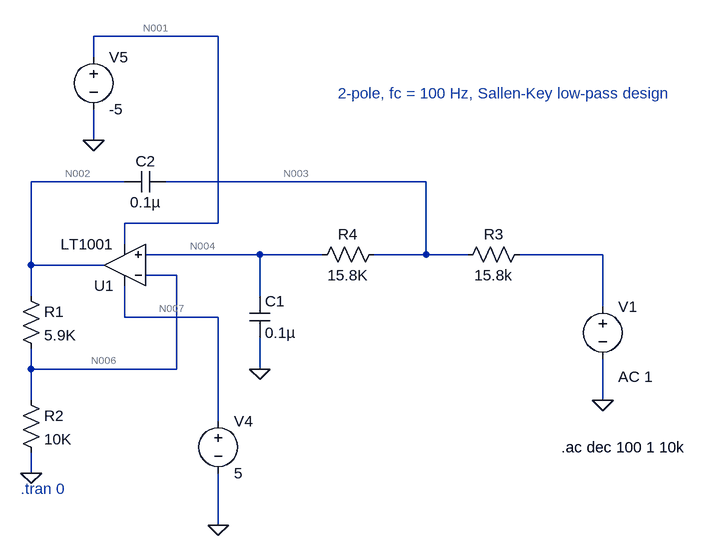
[diagram p0: schematic Draft1.asc]
Draft1.asc, the LTspice schematic file:
Version 4.1
SHEET 1 1392 1204
WIRE -96 304 -288 304
WIRE -288 336 -288 304
WIRE -288 464 -288 416
WIRE -240 528 -384 528
WIRE 224 528 -176 528
WIRE -96 592 -96 304
WIRE -96 592 -240 592
WIRE -240 624 -240 592
WIRE -32 640 -208 640
WIRE 64 640 -32 640
WIRE 224 640 224 528
WIRE 224 640 144 640
WIRE 288 640 224 640
WIRE 496 640 368 640
WIRE -384 656 -384 528
WIRE -272 656 -384 656
WIRE -160 672 -208 672
WIRE -384 704 -384 656
WIRE -32 704 -32 640
WIRE 496 720 496 640
WIRE -240 736 -240 688
WIRE -96 736 -240 736
WIRE -384 816 -384 784
WIRE -160 816 -160 672
WIRE -160 816 -384 816
WIRE -32 816 -32 768
WIRE -384 864 -384 816
WIRE 496 864 496 800
WIRE -96 896 -96 736
WIRE -384 976 -384 944
WIRE -96 1056 -96 976
FLAG -384 976 0
FLAG -32 816 0
FLAG 496 864 0
FLAG -96 1056 0
FLAG -288 464 0
SYMBOL res -400 688 R0
SYMATTR InstName R1
SYMATTR Value 5.9K
SYMATTR SpiceLine tol=1 pwr=0.1
SYMBOL res -400 848 R0
SYMATTR InstName R2
SYMATTR Value 10K
SYMATTR SpiceLine tol=1 pwr=0.1
SYMBOL voltage 496 704 R0
WINDOW 123 24 124 Left 2
WINDOW 39 0 0 Left 0
SYMATTR InstName V1
SYMATTR Value ""
SYMATTR Value2 AC 1
SYMBOL cap -176 512 R90
WINDOW 0 0 32 VBottom 2
WINDOW 3 32 32 VTop 2
SYMATTR InstName C2
SYMATTR Value 0.1µ
SYMATTR SpiceLine V=25 Irms=1.34 Rser=0.0989014 Lser=0 mfg="KEMET" pn="C0805C104K3RAC" type="X7R"
SYMBOL res 384 624 R90
WINDOW 0 0 56 VBottom 2
WINDOW 3 32 56 VTop 2
SYMATTR InstName R3
SYMATTR Value 15.8k
SYMBOL res 160 624 R90
WINDOW 0 0 56 VBottom 2
WINDOW 3 32 56 VTop 2
SYMATTR InstName R4
SYMATTR Value 15.8K
SYMATTR SpiceLine tol=1 pwr=0.1
SYMBOL cap -48 704 R0
SYMATTR InstName C1
SYMATTR Value 0.1µ
SYMATTR SpiceLine V=4 Irms=0 Rser=0 Lser=0 mfg="Murata" pn="GRM022R60G333KE15" type="X5R"
SYMBOL OpAmps\\LT1001 -240 720 R180
SYMATTR InstName U1
SYMBOL voltage -96 880 R0
WINDOW 123 0 0 Left 0
WINDOW 39 0 0 Left 0
SYMATTR InstName V4
SYMATTR Value 5
SYMBOL voltage -288 320 R0
WINDOW 123 0 0 Left 0
WINDOW 39 0 0 Left 0
SYMATTR InstName V5
SYMATTR Value -5
TEXT 88 392 Left 2 ;2-pole, fc = 100 Hz, Sallen-Key low-pass design
TEXT -400 1000 Left 2 ;.tran 0
TEXT 432 936 Left 2 !.ac dec 100 1 10k

The netlist it stands for:
* Draft1.asc
R1 N002 N006 5.9K tol=1 pwr=0.1
R2 N006 0 10K tol=1 pwr=0.1
V1 N005 0 AC 1
C2 N003 N002 0.1µ V=25 Irms=1.34 Rser=0.0989014 Lser=0 mfg="KEMET" pn="C0805C104K3RAC" type="X7R"
R3 N005 N003 15.8k
R4 N003 N004 15.8K tol=1 pwr=0.1
C1 N004 0 0.1µ V=4 Irms=0 Rser=0 Lser=0 mfg="Murata" pn="GRM022R60G333KE15" type="X5R"
X§U1 N004 N006 N007 N001 N002 LT1001  ; pins In+ In- V+ V- OUT
V4 N007 0 5
V5 N001 0 -5
* 2-pole, fc = 100 Hz, Sallen-Key low-pass design
* .tran 0
.ac dec 100 1 10k
.lib LTC.lib
.backanno
.end

* Results of the author's LTspice run, read from the files saved beside the schematic
* Operating Point, zero values left out:
*   V(n001) = -5 V
*   V(n007) = 5 V
*   I(V4) = -2.25 mA
*   I(V5) = 2.25 mA
*   Ix(u1:3) = 2.25 mA
*   Ix(u1:4) = -2.25 mA
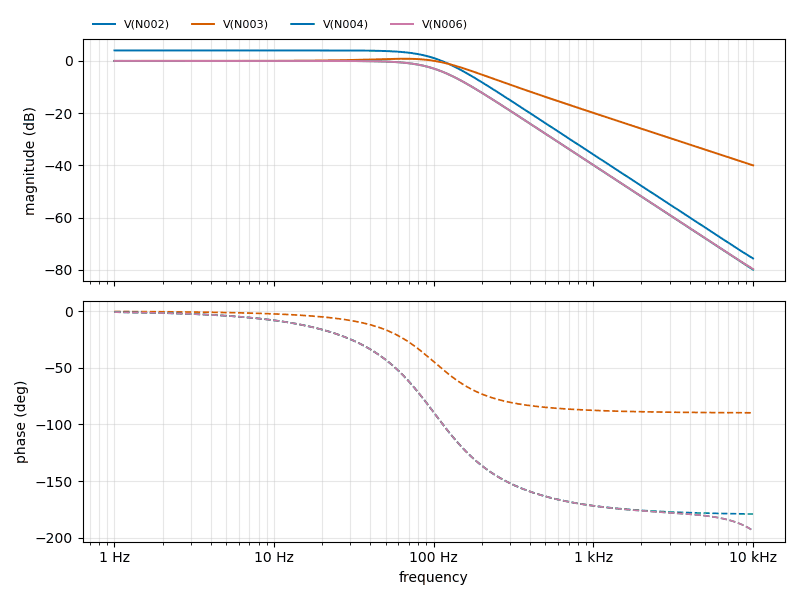
[diagram p1: AC Analysis of Draft1.asc, plotted from the saved traces]
* AC Analysis, 1 run:
*   V(N002): 4.03 dB at 1 Hz, -75.60 dB at 10 kHz, peak 4.03 dB at 7.943 Hz, 3 dB below the peak at 101 Hz
*   V(N003): 0.00 dB at 1 Hz, -39.97 dB at 10 kHz, peak 0.84 dB at 64.57 Hz, 3 dB below the peak at 142 Hz
*   V(N004): 0.00 dB at 1 Hz, -79.91 dB at 10 kHz, peak 0.00 dB at 7.943 Hz, 3 dB below the peak at 101 Hz
*   V(N006): -0.00 dB at 1 Hz, -79.63 dB at 10 kHz, peak 0.00 dB at 7.943 Hz, 3 dB below the peak at 101 Hz